# Altium schematic sheet uwb_module.SchDoc
size A4; SheetNumber: 4; SheetTotal: 5
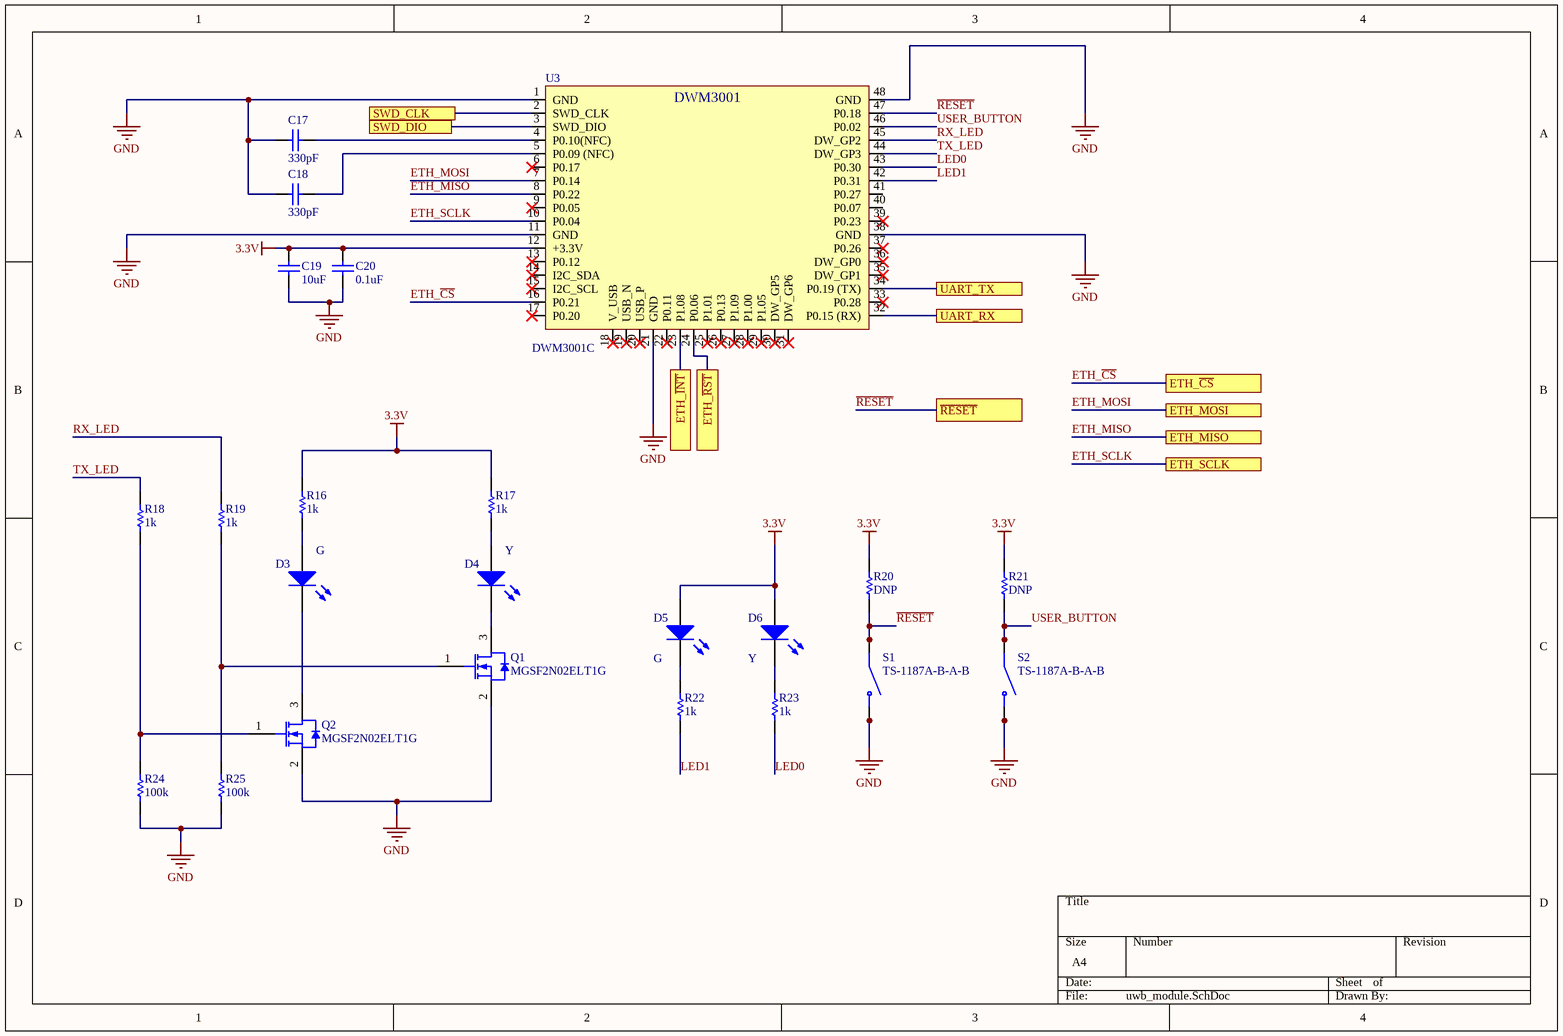
[diagram p0: uwb_module.SchDoc]

## Parts
C17  value 330pF  [0603 - Capacitor]  (hidden comment: Capacitor - Nonpolarized)
C18  value 330pF  [0603 - Capacitor]  (hidden comment: Capacitor - Nonpolarized)
C19  value 10uF  [0603 - Capacitor]  (hidden comment: Capacitor - Nonpolarized)
C20  value 0.1uF  [0603 - Capacitor]  (hidden comment: Capacitor - Nonpolarized)
D3  LED  [0805 LED]  (value not drawn)
D4  LED  [0805 LED]  (value not drawn)
D5  LED  [0805 LED]  (value not drawn)
D6  LED  [0805 LED]  (value not drawn)
Q1  MGSF2N02ELT1G  [ONSC-SOT-23-3-318-08_V]
Q2  MGSF2N02ELT1G  [ONSC-SOT-23-3-318-08_V]
R16  value 1k  [0603 - Resistor]  (hidden comment: Resistor)
R17  value 1k  [0603 - Resistor]  (hidden comment: Resistor)
R18  value 1k  [0603 - Resistor]  (hidden comment: Resistor)
R19  value 1k  [0603 - Resistor]  (hidden comment: Resistor)
R20  value DNP  [0603 - Resistor]  (hidden comment: Resistor)
R21  value DNP  [0603 - Resistor]  (hidden comment: Resistor)
R22  value 1k  [0603 - Resistor]  (hidden comment: Resistor)
R23  value 1k  [0603 - Resistor]  (hidden comment: Resistor)
R24  value 100k  [0603 - Resistor]  (hidden comment: Resistor)
R25  value 100k  [0603 - Resistor]  (hidden comment: Resistor)
S1  TS-1187A-B-A-B  [SW_TS-1187A-B-A-B]
S2  TS-1187A-B-A-B  [SW_TS-1187A-B-A-B]
U3  DWM3001C  [DWM3001C]

## Ports
ETH_MISO (see main[4B]), ETH_MOSI (see main[4B]), ETH_SCLK (see main[4B]), ETH_~{CS} (see main[4B]), ETH_~{INT} (see main[4B]), ETH_~{RST} (see main[4B]), SWD_CLK (see main[4C]), SWD_DIO (see main[4C]), UART_RX (see main[4C]), UART_TX (see main[4C]), ~{RESET} (see main[4C])

## Nets
3.3V: C19.1 C20.1 D5.1(A) D6.1(A) R16.2 R17.2 R20.2 R21.2 U3.12(+3.3V)
GND: C17.2 C18.2 C19.2 C20.2 Q1.2(S) Q2.2(S) R24.1 R25.1 S1.C(NO) S1.D(NO) S2.C(NO) S2.D(NO) U3.1(GND) U3.11(GND) U3.21(GND) U3.38(GND) U3.48(GND)
ETH_~{CS}: U3.16(P0.21) ; port ETH_~{CS}
ETH_~{INT}: U3.23(P1.08) ; port ETH_~{INT}
ETH_MISO: U3.8(P0.22) ; port ETH_MISO
ETH_MOSI: U3.7(P0.14) ; port ETH_MOSI
ETH_~{RST}: U3.24(P0.06) ; port ETH_~{RST}
ETH_SCLK: U3.10(P0.04) ; port ETH_SCLK
LED0: R23.1 U3.43(P0.30)
LED1: R22.1 U3.42(P0.31)
~{RESET}: R20.1 S1.A(COM) S1.B(COM) U3.47(P0.18) ; port ~{RESET}
RX_LED: R19.2 U3.45(DW_GP2)
SWD_CLK: U3.2(SWD_CLK) ; port SWD_CLK
SWD_DIO: U3.3(SWD_DIO) ; port SWD_DIO
TX_LED: R18.2 U3.44(DW_GP3)
UART_RX: U3.32(P0.15_(RX)) ; port UART_RX
UART_TX: U3.34(P0.19_(TX)) ; port UART_TX
USER_BUTTON: R21.1 S2.A(COM) S2.B(COM) U3.46(P0.02)
NetC17_1: C17.1 U3.4(P0.10(NFC))
NetC18_1: C18.1 U3.5(P0.09_(NFC))
NetD3_1: D3.1(A) R16.1
NetD3_2: D3.2(K) Q2.3(D)
NetD4_1: D4.1(A) R17.1
NetD4_2: D4.2(K) Q1.3(D)
NetD5_2: D5.2(K) R22.2
NetD6_2: D6.2(K) R23.2
NetQ1_1: Q1.1(G) R19.1 R25.2
NetQ2_1: Q2.1(G) R18.1 R24.2

Not connected (* = marked no-connect by the designer): U3 6(P0.17)* 9(P0.05)* 13(P0.12)* 14(I2C_SDA)* 15(I2C_SCL)* 17(P0.20)* 18(V_USB)* 19(USB_N)* 20(USB_P)* 22(P0.11)* 25(P1.01)* 26(P0.13)* 27(P1.09)* 28(P1.00)* 29(P1.05)* 30(DW_GP5)* 31(DW_GP6)* 33(P0.28)* 35(DW_GP1)* 36(DW_GP0)* 37(P0.26)* 39(P0.23)* 40(P0.07) 41(P0.27)

## Notes on the sheet
- G
- Y
- (in symbol DWM3001C) DWM3001

## Library data of the parts
C17 C18 = Capacitor - Nonpolarized: Nonpolarized Capacitor; Manufacturer: Samsung Electro-Mechanics; Manufacturer Part Number: CL10C331JB8NNNC; Rating: 50V; Supplier Part Number: C1664; Supplier: JLCPCB; Link: https://jlcpcb.com/partdetail/2016-CL10C331JB8NNNC/C1664
C19 C20 = Capacitor - Nonpolarized: Nonpolarized Capacitor; Manufacturer: YAGEO; Manufacturer Part Number: CC0603KRX7R9BB104; Rating: 50V X7R +/-10%; Supplier Part Number: C14663; Supplier: JLCPCB; Link: https://jlcpcb.com/partdetail/Yageo-CC0603KRX7R9BB104/C14663
D3 D5 = LED: Light Emitting Diode; Manufacturer Part Number: C2297; Manufacturer: Hubei KENTO Elec; Value: *; Supplier Part Number: C2297; Rating: *; Supplier: JLCPCB; Link: https://jlcpcb.com/partdetail/Hubei_KentoElec-C2297/C2297
D4 D6 = LED: Light Emitting Diode; Manufacturer Part Number: C2296; Manufacturer: Hubei KENTO Elec; Value: *; Supplier Part Number: C2296; Rating: *; Supplier: JLCPCB; Link: https://jlcpcb.com/partdetail/Hubei_KentoElec-C2296/C2296
Q1 Q2 = CMP-1058-00775-1: Power MOSFET, 2.8 A, 20 V, N-Channel, 3-Pin SOT-23, Pb-Free, Tape and Reel; Manufacturer: On Semiconductor; Link: https://jlcpcb.com/partdetail/Onsemi-MGSF2N02ELT1G/C236232; Manufacturer Part Number: MGSF2N02ELT1G; Supplier: JLCPCB; Supplier Part Number: C236232
R16-R19 R22 R23 = Resistor: Manufacturer Part Number: 0603WAF1001T5E; Manufacturer: UNI-ROYAL(Uniroyal Elec); Rating: 100mW; Supplier Part Number: C21190; Supplier: JLCPCB; Link: https://jlcpcb.com/partdetail/21904-0603WAF1001T5E/C21190
R24 R25 = Resistor: Manufacturer Part Number: 0603WAF1003T5E; Manufacturer: UNI-ROYAL(Uniroyal Elec); Rating: 100mW; Supplier Part Number: C25803; Supplier: JLCPCB; Link: https://jlcpcb.com/partdetail/26546-0603WAF1003T5E/C25803
S1 S2 = TS-1187A-B-A-B: SPST 50mA @ 12VDC Top Actuated Round Button 160gf SMD Tactile Switches RoHS; Manufacturer: XKB Connectivity; Value: *; Supplier: JLCPCB; Manufacturer Part Number: TS-1187A-B-A-B; Supplier Part Number: C318884
  S1: Link: https://jlcpcb.com/partdetail/XkbConnectivity-TS_1187A_B_AB/C318884
U3 = DWM3001C: Manufacturer: Qorvo; Link: https://store.qorvo.com/products/detail/dwm3001c-qorvo/692453/; Manufacturer Part Number: DWM3001C; Supplier: Qorvo; Supplier Part Number: DWM3001C
R20 R21 = Resistor: Rating: *; Manufacturer Part Number: *; Manufacturer: *; Supplier Part Number: *; Supplier: *